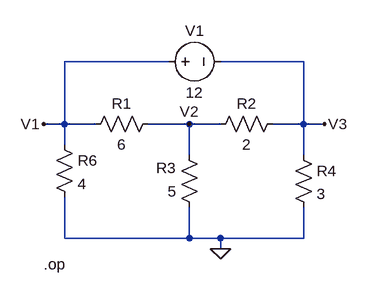
[diagram p0: schematic nodal5.asc]
nodal5.asc, the LTspice schematic file:
Version 4
SHEET 1 880 680
WIRE 144 16 -16 16
WIRE 352 16 224 16
WIRE -16 112 -16 16
WIRE -16 112 -48 112
WIRE 32 112 -16 112
WIRE 176 112 112 112
WIRE 224 112 176 112
WIRE 352 112 352 16
WIRE 352 112 304 112
WIRE 384 112 352 112
WIRE -16 144 -16 112
WIRE 176 160 176 112
WIRE 352 160 352 112
WIRE -16 288 -16 224
WIRE 176 288 176 240
WIRE 176 288 -16 288
WIRE 224 288 176 288
WIRE 352 288 352 240
WIRE 352 288 224 288
WIRE 224 304 224 288
FLAG 176 112 V2
FLAG 384 112 V3
FLAG 224 304 0
FLAG -48 112 V1
SYMBOL res 320 96 R90
WINDOW 0 0 56 VBottom 2
WINDOW 3 32 56 VTop 2
SYMATTR InstName R2
SYMATTR Value 2
SYMBOL res 192 256 R180
WINDOW 0 36 76 Left 2
WINDOW 3 36 40 Left 2
SYMATTR InstName R3
SYMATTR Value 5
SYMBOL res -32 128 R0
SYMATTR InstName R6
SYMATTR Value 4
SYMBOL res 336 144 R0
SYMATTR InstName R4
SYMATTR Value 3
SYMBOL res 16 128 R270
WINDOW 0 32 56 VTop 2
WINDOW 3 0 56 VBottom 2
SYMATTR InstName R1
SYMATTR Value 6
SYMBOL voltage 128 16 R270
WINDOW 0 32 56 VTop 2
WINDOW 3 -32 56 VBottom 2
WINDOW 123 0 0 Left 0
WINDOW 39 0 0 Left 0
SYMATTR InstName V1
SYMATTR Value 12
TEXT -48 328 Left 2 !.op

The netlist it stands for:
* nodal5.asc
R2 V3 V2 2
R3 0 V2 5
R6 V1 0 4
R4 V3 0 3
R1 V1 V2 6
V1 V1 V3 12
.op
.backanno
.end

* Results of the author's LTspice run, read from the files saved beside the schematic
* Operating Point:
*   V(v3) = -4.696 V
*   V(v2) = -1.304 V
*   V(v1) = 7.304 V
*   I(R1) = 1.435 A
*   I(R4) = -1.565 A
*   I(R6) = 1.826 A
*   I(R3) = 260.9 mA
*   I(R2) = -1.696 A
*   I(V1) = -3.261 A